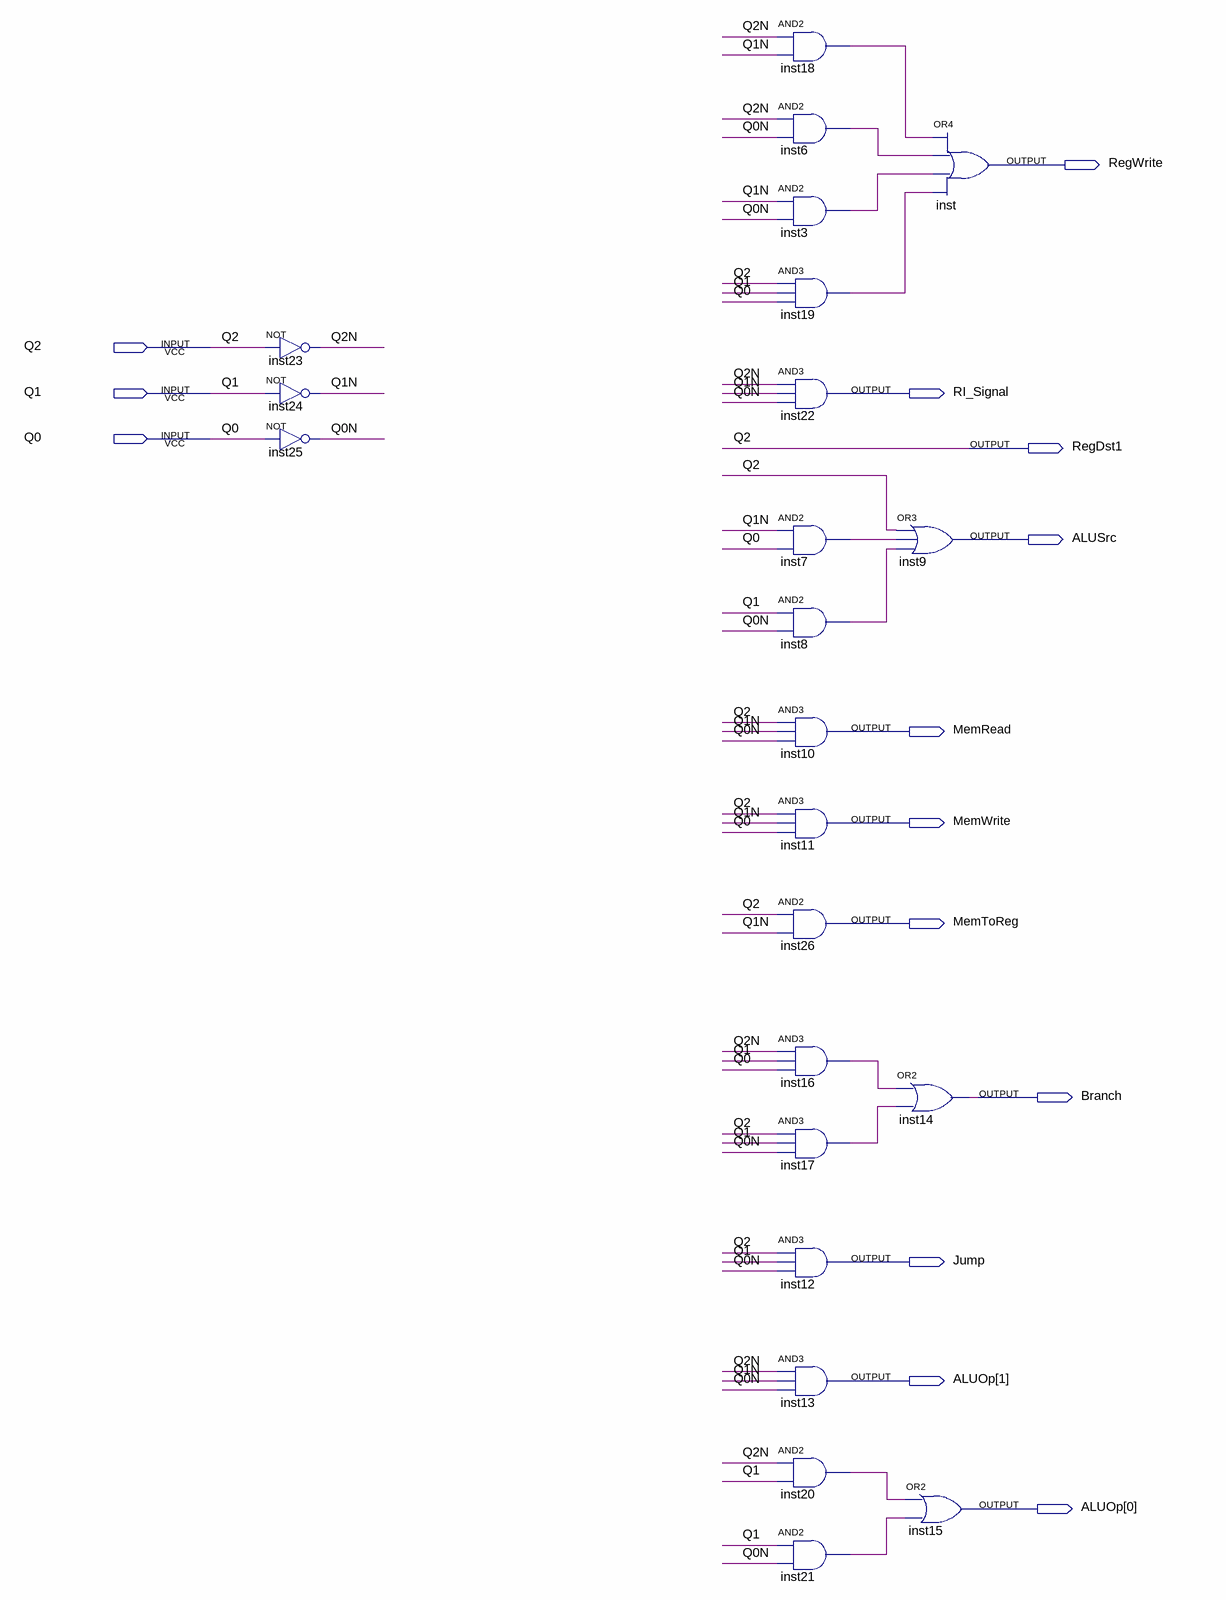
[diagram p0: schematic sheet]
// Quartus schematic ControlUnit.bdf as structural Verilog: 23 symbols, 14 pins
module ControlUnit (
  input  Q2,
  input  Q1,
  input  Q0,
  output RegWrite,
  output RI_Signal,
  output RegDst1,
  output ALUSrc,
  output MemRead,
  output MemWrite,
  output MemToReg,
  output Branch,
  output Jump,
  output [1:0] ALUOp
);

  wire inst3_out, inst6_out, inst7_out, inst8_out, inst16_out, inst17_out, inst18_out, inst19_out,
       inst20_out, inst21_out, Q0N, Q1N, Q2N;

  not inst23 (Q2N, Q2);
  not inst24 (Q1N, Q1);
  not inst25 (Q0N, Q0);
  and inst18 (inst18_out, Q2N, Q1N);
  and inst6 (inst6_out, Q2N, Q0N);
  and inst3 (inst3_out, Q1N, Q0N);
  and inst19 (inst19_out, Q2, Q1, Q0);
  and inst22 (RI_Signal, Q2N, Q1N, Q0N);
  and inst7 (inst7_out, Q1N, Q0);
  and inst8 (inst8_out, Q1, Q0N);
  and inst10 (MemRead, Q2, Q1N, Q0N);
  and inst11 (MemWrite, Q2, Q1N, Q0);
  and inst26 (MemToReg, Q2, Q1N);
  and inst16 (inst16_out, Q2N, Q1, Q0);
  and inst17 (inst17_out, Q2, Q1, Q0N);
  and inst12 (Jump, Q2, Q1, Q0N);
  and inst13 (ALUOp[1], Q2N, Q1N, Q0N);
  and inst20 (inst20_out, Q2N, Q1);
  and inst21 (inst21_out, Q1, Q0N);
  or inst9 (ALUSrc, Q2, inst7_out, inst8_out);
  or inst14 (Branch, inst16_out, inst17_out);
  or inst15 (ALUOp[0], inst20_out, inst21_out);
  or inst (RegWrite, inst18_out, inst6_out, inst3_out, inst19_out);

  assign RegDst1 = Q2;
endmodule
